# EAGLE design Adafruit Metro ESP32-S2 (EAGLE 9.6.2)
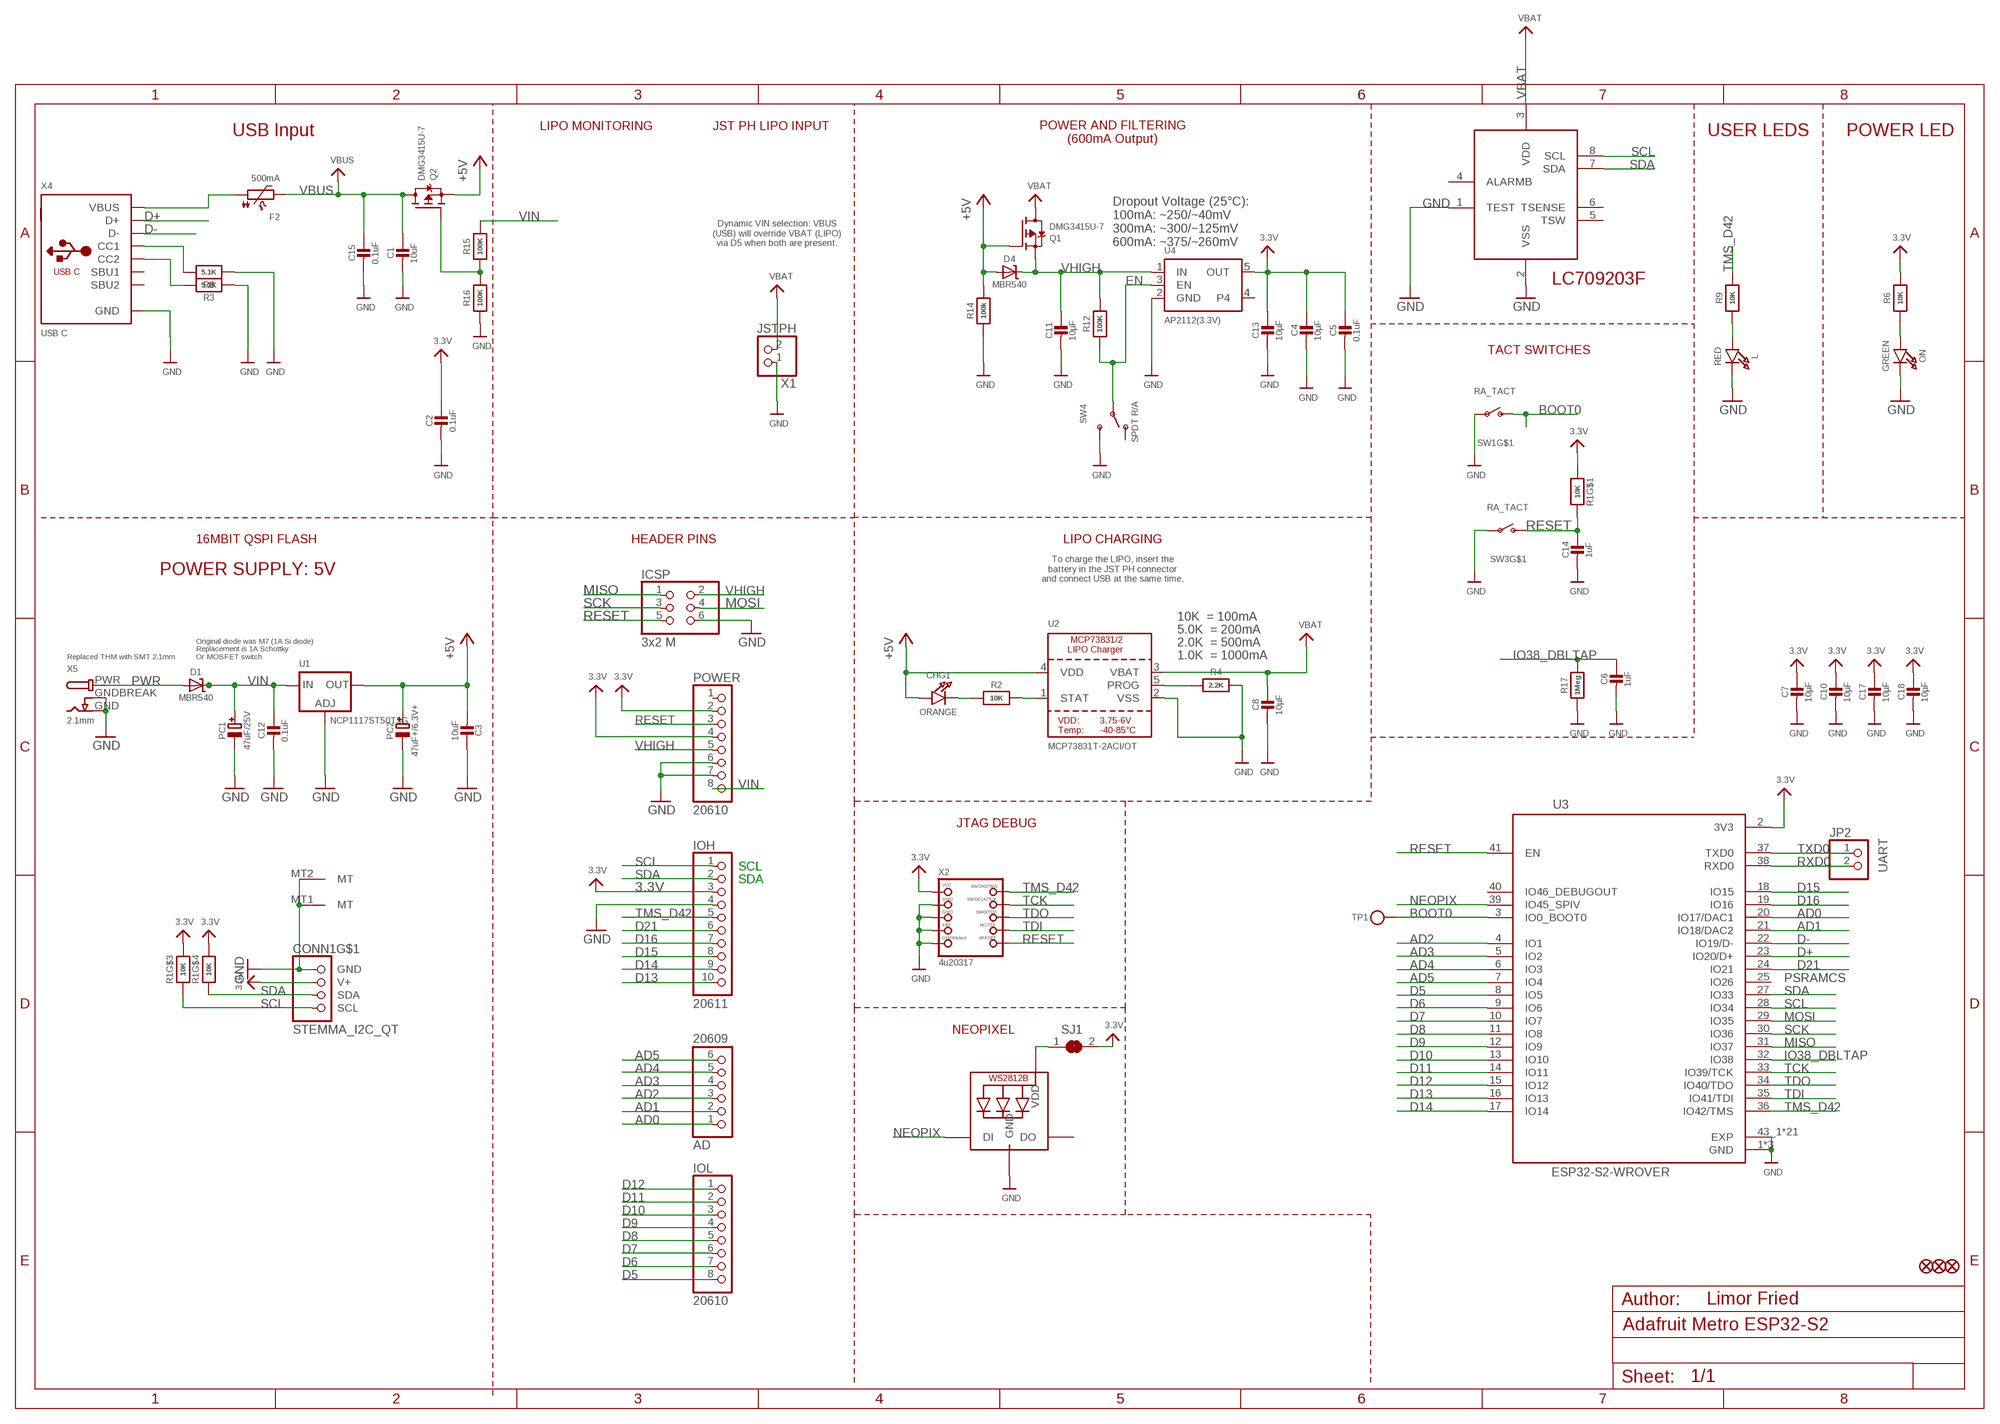
[diagram p0: schematic, sheet 1]

## Parts
AD  20609  HEADER-1X6OVALWAVE  [1X06_OVALWAVE]
C1  10uF  CAP_CERAMIC0805-NOOUTLINE  [0805-NO]
C2  0.1uF  CAP_CERAMIC0603_NO  [0603-NO]
C3  10uF  CAP_CERAMIC0805-NOOUTLINE  [0805-NO]
C4  10µF  CAP_CERAMIC0805-NOOUTLINE  [0805-NO]
C5  0.1uF  CAP_CERAMIC0603_NO  [0603-NO]
C6  1uF  CAP_CERAMIC0603_NO  [0603-NO]
C7  10µF  CAP_CERAMIC0805-NOOUTLINE  [0805-NO]
C8  10µF  CAP_CERAMIC0805-NOOUTLINE  [0805-NO]
C10  10µF  CAP_CERAMIC0805-NOOUTLINE  [0805-NO]
C11  10µF  CAP_CERAMIC0805-NOOUTLINE  [0805-NO]
C12  0.1uF  CAP_CERAMIC0603_NO  [0603-NO]
C13  10µF  CAP_CERAMIC0805-NOOUTLINE  [0805-NO]
C14  1uF  CAP_CERAMIC0603_NO  [0603-NO]
C15  0.1uF  CAP_CERAMIC0603_NO  [0603-NO]
C17  10µF  CAP_CERAMIC0805-NOOUTLINE  [0805-NO]
C18  10µF  CAP_CERAMIC0805-NOOUTLINE  [0805-NO]
CHG1  ORANGE  LED0603_NOOUTLINE  [CHIPLED_0603_NOOUTLINE]
CONN1  STEMMA_I2C_QT  [JST_SH4]
D1  MBR540  DIODE-SCHOTTKYSOD-123  [SOD-123]
D4  MBR540  DIODE-SCHOTTKYSOD-123  [SOD-123]
F2  500mA  PTC1206  [1206]
FD1  FIDUCIAL_1MM  [FIDUCIAL_1MM]
FD2  FIDUCIAL_1MM  [FIDUCIAL_1MM]
FD3  FIDUCIAL_1MM  [FIDUCIAL_1MM]
IC2  LC709203F  [WDFN8_3X4_0.65]
ICSP  3x2 M  HEADER-2X3  [2X03_ROUND_70MIL]
IOH  20611  HEADER-1X10OVALWAVE  [1X10_OVALWAVE]
IOL  20610  HEADER-1X8OVALWAVE  [1X08_OVALWAVE]
JP2  UART  HEADER-1X2ROUND  [1X02_ROUND]
L  RED  LED0603_NOOUTLINE  [CHIPLED_0603_NOOUTLINE]
LED1  WS2812B3535  [LED3535]
ON  GREEN  LED0603_NOOUTLINE  [CHIPLED_0603_NOOUTLINE]
PC1  47uF/25V  CAP_ELECTROLYTICPANASONIC_D  [PANASONIC_D]
PC2  47uF+/6.3V+  CAP_ELECTROLYTICPANASONIC_D  [PANASONIC_D]
POWER  20610  HEADER-1X8OVALWAVE  [1X08_OVALWAVE]
Q1  DMG3415U-7  MOSFET-P  [SOT23-R]
Q2  DMG3415U-7  MOSFET-P  [SOT23-R]
R1  10K  RESISTOR_4PACK  [RESPACK_4X0603]
R2  10K  RESISTOR_0603_NOOUT  [0603-NO]
R3  5.1K  RESISTOR_0603_NOOUT  [0603-NO]
R4  2.2K  RESISTOR_0603_NOOUT  [0603-NO]
R6  10K  RESISTOR_0603_NOOUT  [0603-NO]
R8  5.1K  RESISTOR_0603_NOOUT  [0603-NO]
R9  10K  RESISTOR_0603_NOOUT  [0603-NO]
R12  100K  RESISTOR_0603_NOOUT  [0603-NO]
R14  100k  RESISTOR_0603_NOOUT  [0603-NO]
R15  100K  RESISTOR_0603_NOOUT  [0603-NO]
R16  100K  RESISTOR_0603_NOOUT  [0603-NO]
R17  1Meg  RESISTOR_0603_NOOUT  [0603-NO]
SJ1  SOLDERJUMPER_CLOSED  [SOLDERJUMPER_CLOSEDWIRE]
SW1  RA_TACT  SWITCH_SPST_TACT_RA  [SPST_TACTILE_RA]
SW3  RA_TACT  SWITCH_SPST_TACT_RA  [SPST_TACTILE_RA]
SW4  SPDT R/A  SWITCH_SPDT  [SPDT_SMT_SSSS811101]
TP1  TESTPOINTROUND1.5MMNO  [TESTPOINT_ROUND_1.5MM_NO]
U1  NCP1117ST50T3G  LM1117SOT223-REFLOW  [SOT223-R]
U2  MCP73831T-2ACI/OT  MCP73831/2  [SOT23-5]
U3  ESP32-S2-WROVER  [MODULE_ESP32-S2-WROVER]
U4  AP2112(3.3V)  VREG_SOT23-5  [SOT23-5]
X1  JSTPH  CON_JST_PH_2PIN_BATT  [JSTPH2_BATT]
X2  4u20317  JTAG-CORTEXBOXPOSTS  [2X05_1.27MM_BOX_POSTS]
X4  USB C  USB_C  [USB_C_CUSB31-CFM2AX-01-X]
X5  2.1mm  DCBARRELPTH  [DCJACK_2MM_PTH]

## Nets
3.3V [Power]: C2.1 C4.1 C5.1 C7.1 C10.1 C13.1 C17.1 C18.1 CONN1.2(V+) IOH.3 POWER.2 POWER.4 R1.1 R1.5 R1.6 R6.2 SJ1.2 U3.2(3V3) U4.5(OUT) X2.1(VCC)
+5V [Power]: C3.2 CHG1.A D4.A PC2.+ Q1.1(G) Q2.2(S) R14.2 U1.2(OUT) U1.4(OUT) U2.4(VDD)
AD0: AD.1 U3.20(IO17/DAC1)
AD1: AD.2 U3.21(IO18/DAC2)
AD2: AD.3 U3.4(IO1)
AD3: AD.4 U3.5(IO2)
AD4: AD.5 U3.6(IO3)
AD5: AD.6 U3.7(IO4)
BOOT0: SW1.2(S) TP1.P$1 U3.3(IO0_BOOT0)
D5: IOL.8 U3.8(IO5)
D6: IOL.7 U3.9(IO6)
D7: IOL.6 U3.10(IO7)
D8: IOL.5 U3.11(IO8)
D9: IOL.4 U3.12(IO9)
D10: IOL.3 U3.13(IO10)
D11: IOL.2 U3.14(IO11)
D12: IOL.1 U3.15(IO12)
D13: IOH.10 U3.16(IO13)
D14: IOH.9 U3.17(IO14)
D15: IOH.8 U3.18(IO15)
D16: IOH.7 U3.19(IO16)
D21: IOH.6 U3.24(IO21)
D+: U3.23(IO20/D+) X4.A6(D+) X4.B6(D+)
D-: U3.22(IO19/D-) X4.A7(D-) X4.B7(D-)
EN: R12.1 SW4.B(P) U4.3(EN)
GND [lowpower]: C1.2 C2.2 C3.1 C4.2 C5.2 C6.2 C7.2 C8.2 C10.2 C11.2 C12.2 C13.2 C14.2 C15.2 C17.2 C18.2 CONN1.1(GND) CONN1.MT1(MT) CONN1.MT2(MT) IC2.1(TEST) IC2.2(VSS) ICSP.6 IOH.4 L.C LED1.4(GND) ON.C PC1.- PC2.- POWER.6 POWER.7 R3.1 R4.2 R8.1 R14.1 R16.1 R17.1 SW1.1(P) SW3.1(P) SW4.C(S) U1.1(ADJ) U2.2(VSS) U3.1(GND) U3.26(GND) U3.42(GND) U3.43_1(EXP) U3.43_2(EXP) U3.43_3(EXP) U3.43_4(EXP) U3.43_5(EXP) U3.43_6(EXP) U3.43_7(EXP) U3.43_8(EXP) U3.43_9(EXP) U3.43_10(EXP) U3.43_11(EXP) U3.43_12(EXP) U3.43_13(EXP) U3.43_14(EXP) U3.43_15(EXP) U3.43_16(EXP) U3.43_17(EXP) U3.43_18(EXP) U3.43_19(EXP) U3.43_20(EXP) U3.43_21(EXP) U4.2(GND) X1.1 X2.3(GND) X2.5(GND) X2.7(KEY) X2.9(GNDDETECT) X4.A1B12(GND) X4.B1A12(GND) X5.GND X5.GNDBREAK
IO38_DBLTAP: C6.1 R17.2 U3.32(IO38)
MISO: ICSP.1 U3.31(IO37)
MOSI: ICSP.4 U3.29(IO35)
N$1: L.A R9.1
N$2: Q2.1(G) R15.1 R16.2
N$3: ON.A R6.1
N$4: CHG1.C R2.1
N$5 [Power]: LED1.2(VDD) SJ1.1
N$6: R2.2 U2.1(STAT)
N$7: R8.2 X4.A5(CC1)
N$8: R3.2 X4.B5(CC2)
N$9: R4.1 U2.5(PROG)
N$13: F2.1 X4.A4B9(VBUS) X4.B4A9(VBUS)
NEOPIX: LED1.1(DI) U3.39(IO45_SPIV)
PWR: D1.A X5.PWR
RESET: C14.1 ICSP.5 POWER.3 R1.8 SW3.2(S) U3.41(EN) X2.10(NRESET)
RXD0: JP2.2 U3.38(RXD0)
SCK: ICSP.3 U3.30(IO36)
SCL: CONN1.4(SCL) IC2.8(SCL) IOH.1 R1.3 U3.28(IO34)
SDA: CONN1.3(SDA) IC2.7(SDA) IOH.2 R1.4 U3.27(IO33)
TCK: U3.33(IO39/TCK) X2.4(SWDCLK)
TDI: U3.35(IO41/TDI) X2.8(TDI)
TDO: U3.34(IO40/TDO) X2.6(SWO)
TMS_D42: IOH.5 R9.2 U3.36(IO42/TMS) X2.2(SWDIO)
TXD0: JP2.1 U3.37(TXD0)
VBAT [Power]: C8.1 IC2.3(VDD) Q1.3(D) U2.3(VBAT) X1.2
VBUS: C1.1 C15.1 F2.2 Q2.3(D)
VHIGH [Power]: C11.1 D4.C ICSP.2 POWER.5 Q1.2(S) R12.2 U4.1(IN)
VIN [USB]: C12.1 D1.C PC1.+ POWER.8 R15.2 U1.3(IN)
Unconnected: IC2.4(ALARMB) IC2.5(TSW) IC2.6(TSENSE) LED1.3(DO) POWER.1 R1.2 R1.7 SW1.MT1(MT) SW1.MT2(MT) SW3.MT1(MT) SW3.MT2(MT) SW4.A(O) U3.25(IO26) U3.40(IO46_DEBUGOUT) U4.4 X4.A8(SBU1) X4.B8(SBU2)

## Notes on the sheet
- USB Input | LIPO MONITORING | JST PH LIPO INPUT | USER LEDS | POWER LED
- POWER AND FILTERING
  (600mA Output)
- Dynamic VIN selection: VBUS
  (USB) will override VBAT (LIPO)
  via D5 when both are present.
- Dropout Voltage (25°C):
  100mA: ~250/~40mV
  300mA: ~300/~125mV
  600mA: ~375/~260mV
- TACT SWITCHES
- 16MBIT QSPI FLASH | HEADER PINS | LIPO CHARGING
- POWER SUPPLY: 5V
- To charge the LIPO, insert the
  battery in the JST PH connector
  and connect USB at the same time.
- 10K  = 100mA
- 5.0K  = 200mA
- 2.0K  = 500mA
- Replaced THM with SMT 2.1mm
- Original diode was M7 (1A Si diode)
  Replacement is 1A Schottky
  Or MOSFET switch
- 1.0K  = 1000mA
- JTAG DEBUG
- SCL
- SDA
- PSRAMCS
- NEOPIXEL
- Limor Fried

## Library data of the parts
AD = microbuilder:HEADER-1X6: PIN HEADER
C1-C8 C10-C15 C17 C18 = microbuilder:CAP_CERAMIC: Ceramic Capacitors For new designs, use the packages preceded by an '_' character since they are more reliable: The following footprints should be used on most boards: _0402 - Standard footprint for regular board layouts _0603 - Standard footprint for regular board layouts _0805 - Standard footprint for regular board layouts _1206 - Standard footprint for regular board layouts For extremely tight-pitch boards where space is at a premium, the following 'micro-pitch' footprints can be used (smaller pads, no silkscreen outline, etc.): _0402MP - Micro-pitch footprint for very dense/compact boards _0603MP - Micro-pitch footprint for very dense/compact boards _0805MP - Micro-pitch footprint for very dense/compact boards _1206MP - Micro-pitch footprint for very dense/compact boards
CHG1 L ON = microbuilder:LED: LED 0603 - 0603 Surface Mount Package 2mA: Green LED - Low Power (3.9mcd, 2ma, 1.7Vf) - Digikey: 475-2709-2-ND Orange LED - Low Power (9.8mcd, 2ma, 1.8Vf) - Digikey: 475-1194-2-ND Red LED - Low Power (5mcd, 2ma, 1.8Vf) - Digikey: 475-1195-2-ND Yellow LED - Low Power (7mcd, 2ma, 1.8Vf) - Digikey: 475-1196-2-ND 5mA: Blue LED - Low Power (17mcd, 5ma, 2.9Vf) - Digikey: LNJ937W8CRACT-ND 0805 - 0805 Surface Mount Package 2mA: Red LED (8.8mcd, 2mA, 1.8Vf, Clear) - Low Power [Digikey: 475-2510-1-ND] Green LED (5mcd, 2mA, 1.8Vf, Clear) - Low Power [Digikey: 475-2730-1-ND] Yellow LED (11.3mcd, 2mA, 1.8Vf, Clear) - Low Power [Digikey: 475-2555-1-ND] 20mA: Red LED (104mcd, 20mA, Diffused) - LS R976 [Digikey: 475-1278-6-ND] Red LED (12mcd, 20mA, 2.0Vf, Clear) - APT2012EC [Digikey: 754-1128-1-ND] Green LED (15mcd, 20mA, 2.2Vf, Clear) - APT2012GC [Digikey: 754-1131-1-ND] Orange LED (160mcd, 20mA, 2.1Vf, Clear) - APT2012SECK [Digikey: 754-1130-1-ND] 1206 - 1206 Surface Mount Package Green LED (26mcd, 20mA, Diffused) - LG N971 [Digikey: 475-1407-6-ND] Red LED (15mcd, 20mA, Diffused) - LH N974 [Digikey: 475-1416-6-ND] Cree - Cree High-Power Surface Mount LEDs XPEBWT-L1-0000-00D50 - White 111lm 350mA 2.9Vf 6200K 110° XTEAWT-00-0000-00000LEE3 - White 114lm 350mA 2.85Vf 5000K 115° Everlight - Everlight 45-21 Series Surface Mount LEDs 45-21/QK2C-B2832AC2CB2/2T - Warm White 2000mcd 20mA 3.25Vf 3050K 120° 45-21/LK2C-B38452C4CB2/2T - Nuetral White 2000mcd 20mA 3.25Vf 4150K 120° 45-21/LK2C-B50634C6CB2/2T - Cold White 2200mcd 20mA 3.25Vf 5650K 120° PLCC2 Reverse Mount LS T77K-J1L2-1-0-2-R18-Z - Red 11.25mcd 2mA 1.8Vf 630nm 120° LO T77K-L1M2-24-Z - Orange 19.6mcd 2mA 1.8Vf 606nm 120° LY T77K-K2M1-26-Z - Yellow 15.7mcd 2mA 1.8Vf 587nm 120°
CONN1 = microbuilder:STEMMA_I2C
D1 D4 = microbuilder:DIODE-SCHOTTKY
F2 = microbuilder:PTC: PTC (Resettable Fuse) 1206 Package 250mA PTC (16V Max, Time-to-Trip: 0.08s) - Digikey: F2110CT-ND 1210 Package 100mA PTC (30V Max, Time-to-Trip: 0.6s) - Digikey: MF-USMF010-2CT-ND 1812 Package 750mA PTC (24V Max, Time-to-Trip: 0.2s) - Digikey: MF-MSMF075/24-2CT-ND
FD1-FD3 = microbuilder:FIDUCIAL: Fiducial Alignment Points Various fiducial points for machine vision alignment.; BOM: EXCLUDE
IC2 = microbuilder:LC709203F
ICSP = microbuilder:HEADER-2X3: PIN HEADER
IOH = microbuilder:HEADER-1X10: PIN HEADER
IOL POWER = microbuilder:HEADER-1X8: PIN HEADER
JP2 = microbuilder:HEADER-1X2: PIN HEADER
LED1 = microbuilder:WS2812B
PC1 PC2 = microbuilder:CAP_ELECTROLYTIC: Electrolytic Capacitors SMT PANASONIC_C - Size C Panasonic Electrolytic Aluminum Capacitor 47µF 16V 20% Electrolytic Capacitor [Digikey: PCE3890TR-ND] PANASONIC_D - Size D Panasonic Electrolytic Aluminum Capacitor 100µF 25V 20% Electrolytic Capacitor [Digikey: PCE3898TR-ND] PTH 3.5 mm grid, 8 mm diameter ... 3.5 mm grid, 10 mm diameter ...
Q1 Q2 = microbuilder:MOSFET-P: P-Channel Mosfet LEGEND VDS: Voltage Drain-Source ID: Drain Current RDS(ON): Drain-Source On-State Resistance VGS(TH): Gate-Source Threshold Voltage CISS: Drain-Source Input Capacitance SOT-23 Name VDS ID RDS(ON) VGS(TH) CISS Order Number IRLML5103 30V 760mA 600 mOhm -- 75pF @ 25V Digikey: IRLML5103PBFCT-ND IRLML6401 12V 4.3A 50 mOhm 950mV @ 250µA 830pF @ 10V Digikey: IRLML6401PBFTR-ND NTR0202PL 20V 400mA 800 mOhm 2.3V @ 250uA 70pF @ 5V Digikey: NTR0202PLT1GOSTR-ND NTR4101PT1G 20V 1.8A 85 mOhm 1.2V @ 250uA 675pF @ 10V Digikey: NTR4101PT1GOSCT-ND DMP2004K 20V 600mA 900 mOhm 1V @ 250uA 175pF @ 16V Digikey: DMP2004KDICT-ND PMV65XP 20V 3.9A 76 mOhm 950mV @ 1mA 725pF @ 20V Digikey: 568-2358-2-ND TO-252 Name VDS ID RDS(ON) VGS(TH) CISS Order Number AOD417 30V 25A 34 mOhm 3V @ 250µA 920pF @ 15V Digikey: 785-1106-2-ND PowerPak Name VDS ID RDS(ON) VGS(TH) CISS Order Number AON7401 30V 12A 14 mOhm 3V @ 250µA 2600pF @ 15V Digikey: 785-1302-1-ND
R1 = microbuilder:RESISTOR_4PACK: Resistor Packs (4 resistors) 4 x 0603 10K 1/16W - Digikey: YC164J-10KCT-ND
R2-R4 R6 R8 R9 R12 R14-R17 = microbuilder:RESISTOR: Resistors For new designs, use the packages preceded by an '_' character since they are more reliable: The following footprints should be used on most boards: _0402 - Standard footprint for regular board layouts _0603 - Standard footprint for regular board layouts _0805 - Standard footprint for regular board layouts _1206 - Standard footprint for regular board layouts For extremely tight-pitch boards where space is at a premium, the following 'micro-pitch' footprints can be used (smaller pads, no silkscreen outline, etc.): _0402MP - Micro-pitch footprint for very dense/compact boards _0603MP - Micro-pitch footprint for very dense/compact boards _0805MP - Micro-pitch footprint for very dense/compact boards _1206MP - Micro-pitch footprint for very dense/compact boards
SJ1 = microbuilder:SOLDERJUMPER_CLOSED: Solder Jumper - Closed These solder jumpers are closed by default CLOSEDWIRE - 10 mil trace between pads that can be cut and resoldered later CLOSEDPERM - 63 mil trace between pads for a permanent connection (used to 'bridge' two signals, a shameless hack for Eagle). Can double as a test point as well (no cream layer)
SW1 SW3 = microbuilder:SWITCH_SPST: Switch - SPST 4UCon 19192 (6.7x2.6mm SMT)
SW4 = microbuilder:SWITCH_SPDT: Switch - SPDT SSSS811101 - Horizontal Two Position SMT, 0.3A 4V [Mouser: 688-SSSS811101]
TP1 = microbuilder:TESTPOINT: Test Point Various test points for characterisation and PCB testing TESTPOINT_SMT - Compact Surface Mount Test Point [Digikey: 5016KTR-ND]
U1 = microbuilder:LM1117: LM1117 Voltage Regulator LM1117 Adjustable Voltage regulator [Digikey: LM1117IMP-ADJDKR-ND] LM1117 3.3V Voltage regulator [AP1117E33GDIDKR-ND] LM1117 5.0V Voltage regulator [AP1117E50GDIDKR-ND] SOT223-REFLOW - SOT223 package for solder paste/reflow ovens SOT223-WAVE - SOT223 package for hand-soldering (larger pads) Note: For the fixed-voltage regulators, simply set the ADJ pin to GND.
U2 = microbuilder:MCP73831/2: MCP73831/2 LIPO Charger VDD: 3.75 - 6V Temp -40 - 85°C Programmable Charge Rate: 15-500mA NOTE: STAT is a tri-state logic output on the MCP73831 and an open-drain output on the MCP73832. SOT23-5 with 4.2V output and tri-state logic on STAT = MCP73831T-2ACI/OT
U3 = adafruit_wireless:ESP32-S2-WROVER: WiFi 802.11b/g/n Transceiver Module 2.4GHz Antenna Not Included Surface Mount Check prices <https://snapeda.com/parts/ESP32-S2-WROVER/Espressif%20Systems/view-part/?ref=eda>; AVAILABILITY: Warning; DESCRIPTION: WiFi 802.11b/g/n Transceiver Module 2.4GHz Antenna Not Included Surface Mount; DIGIKEY-PURCHASE-URL: https://snapeda.com/shop?store=DigiKey&id=4614060; MF: Espressif Systems; MP: ESP32-S2-WROVER; PACKAGE: VFQFN-56 Espressif Systems; PRICE: None
U4 = microbuilder:VREG_SOT23-5: SOT23-5 Fixed Voltage Regulators Part Current Out V Out V In V Dropout θJA (°C/W) TJ (°C) Digikey Part No. ADP121 150mA 3.3V 3.4-5.5V 0.09V @ 150mA -- -- ADP121-AUJZ33R7CT-ND ADP121 150mA 3.0V 3.1-5.5V 0.09V @ 150mA -- -- ADP121-AUJZ30R7CT-ND ADP122 300mA 3.3V 3.4-5.5V 0.085V @ 300mA -- -- ADP122AUJZ-3.3-R7CT-ND ADP1712 300mA 3.3V 3.5-5.5V 0.17V @ 300mA -- -- ADP1712AUJZ-3.3-R7TR-ND AP7311 (Low Cost) 150mA 3.3V 3.5-6V 0.15V @ 150mA -- -- AP7311-33WG-7DICT-ND LD39015M18R 150mA 1.8V 1.9V-5.5V 0.08V @ 100mA -- -- 497-6977-1-ND LP2985A-33DBVR 150mA 3.3V 3.3-16V 0.28V @ 150mA 206 150 296-18479-1-ND MCP1824T-3302E/OT 300mA 3.3V 3.5V-6V 0.2V @ 300mA -- -- MCP1824T-3302E/OTCT-ND MIC5205-2.5YM5 TR 150mA 2.5V 2.7-16V 0.165V @ 150mA -- -- 576-1257-2-ND MIC5205-3.0YM5 TR 150mA 3.0V 3.2V-16V 0.165V @ 150mA -- -- 576-1258-2-ND MIC5205-3.3YM5 TR 150mA 3.3V 3.5V-16V 0.165V @ 150mA -- -- 576-1259-2-ND TPS780330220 150mA 3.3V+2.2V 3.6-5.5V 250mV Max -- -- 296-23332-1-ND TDA3663/N1,135 100mA 3.3V 3.5-45V 0.18V @ 50mA -- -- 568-5343-1-ND Max operating temp can be calculated using θJA, TJ (max junction temperature), and power in watts. Set the "Maximum Ambient Temperature" until it reaches TJ ("Max Junction Temperature"), which is the absolute limit for safe use of the regulator: Heat Sink Temperature Calculator <http://www.daycounter.com/Calculators/Heat-Sink-Temperature-Calculator.phtml> For example, With 12V source into a 3.3V LP2985 and a 30mA load, we are dissipating (12V-3.3V) * 0.03A = 0.261W. With a θJA of 206 °C/W, a TJ of 150°C, and 261mW we can safely use the chip without a heat sink up to 75°C (=147.1°C Junction Temperature).
X1 = microbuilder:CON_JST_PH_2PIN: JST 2-Pin Right-Angle Connector PH-Series - 4UConnector: 17311 SH-Series - 4UConnector: 07278
X2 = microbuilder:JTAG-CORTEX: Serial Wire (SW-DP) Connector Standard 0.05" 10-pin connector is for use with the Cortex M and Cortex A SWD (serial wire debugger) interface (SW-DP) Connectors 2x05_1.27MM_SMT - Inexpensive surface-mount header with bare pins, compatible with standard 10-pin SWD cables (4UCON: 16846) 2x05_1.27MM_BOX_NOPOSTS - Polarised surface-mount box (4UCON with caps: 19735, without caps: 15117 2x05_1.27MM_BOX_POSTS - Polarised surface-mount box with mounting holes (4UCON: 20317) Pinout: http://infocenter.arm.com/help/topic/com.arm.doc.faqs/attached/13634/cortex_debug_connectors.pdf http://www.keil.com/peripherals/coresight/connectors.asp
X4 = microbuilder:USB_C: USB Type-C USB 2.0 Connector
X5 = microbuilder:DCBARREL: DC Barrel Jack DCJACK_1.3MM_PTH - Through Hole 1.3mm Jack (4UConnector: 05536) DCJACK_2MM_PTH - Through Hole 2.0/2.1 Jack (4UConnector: 05537) DCJACK_2MM_SMT - SMT 2.0/2.1mm Jack(4UConnector: 03267)

## Net classes
2 lowpower: width 0.305 mm, drill 0.483 mm
3 Power: width 0.305 mm, drill 0.483 mm

## Board
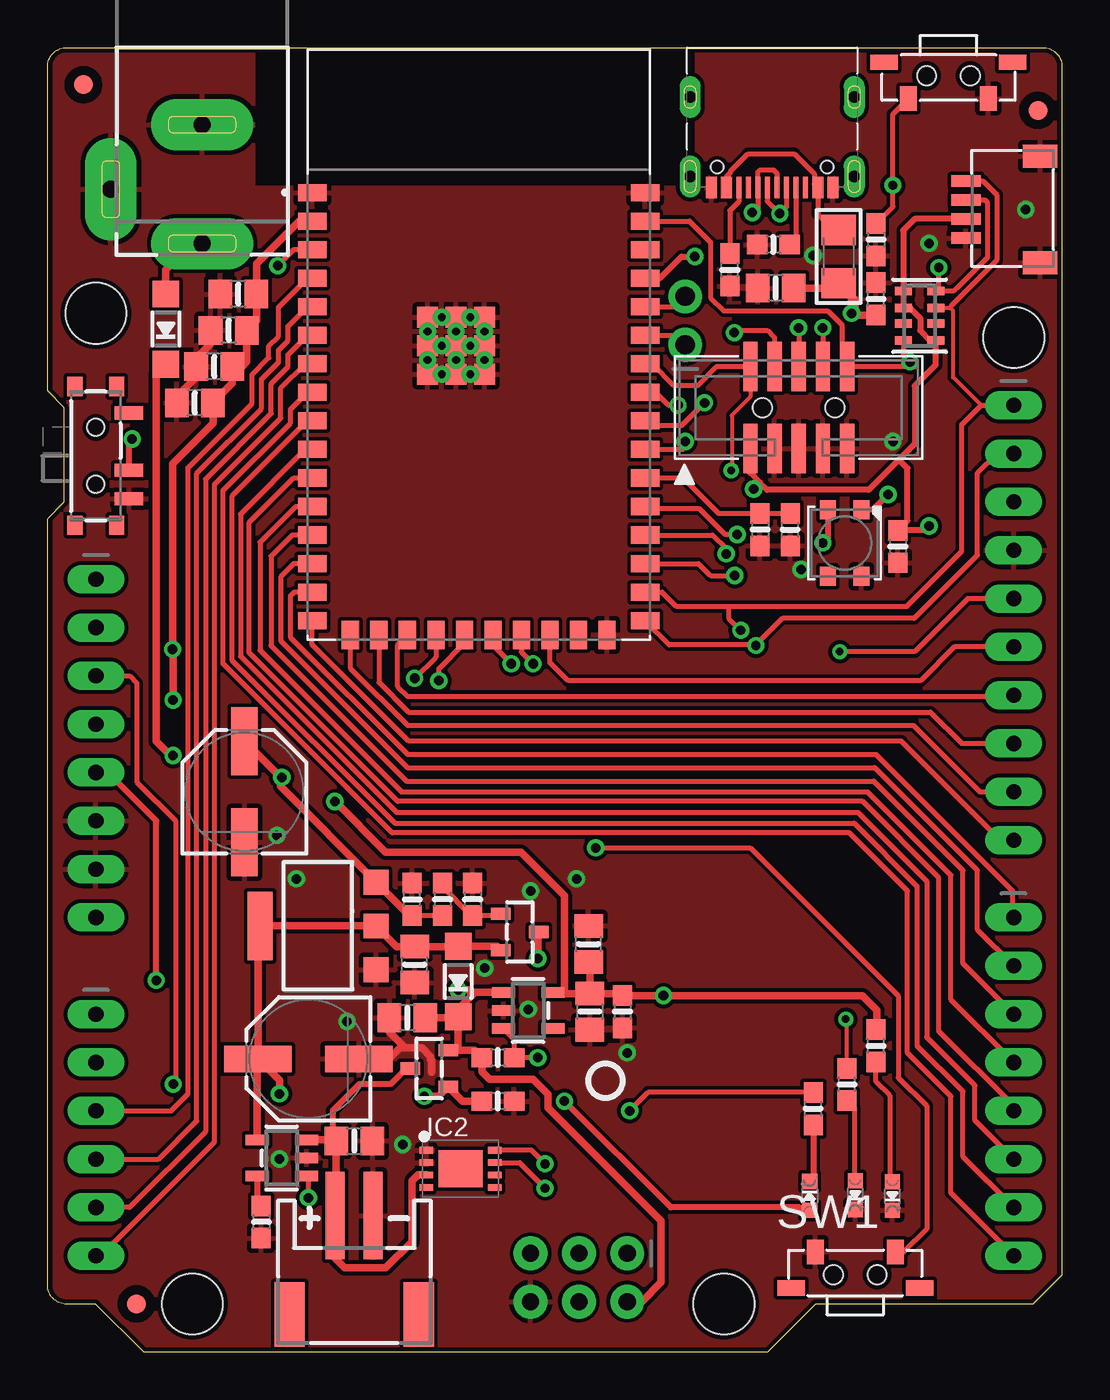
[diagram p1: board, top side]
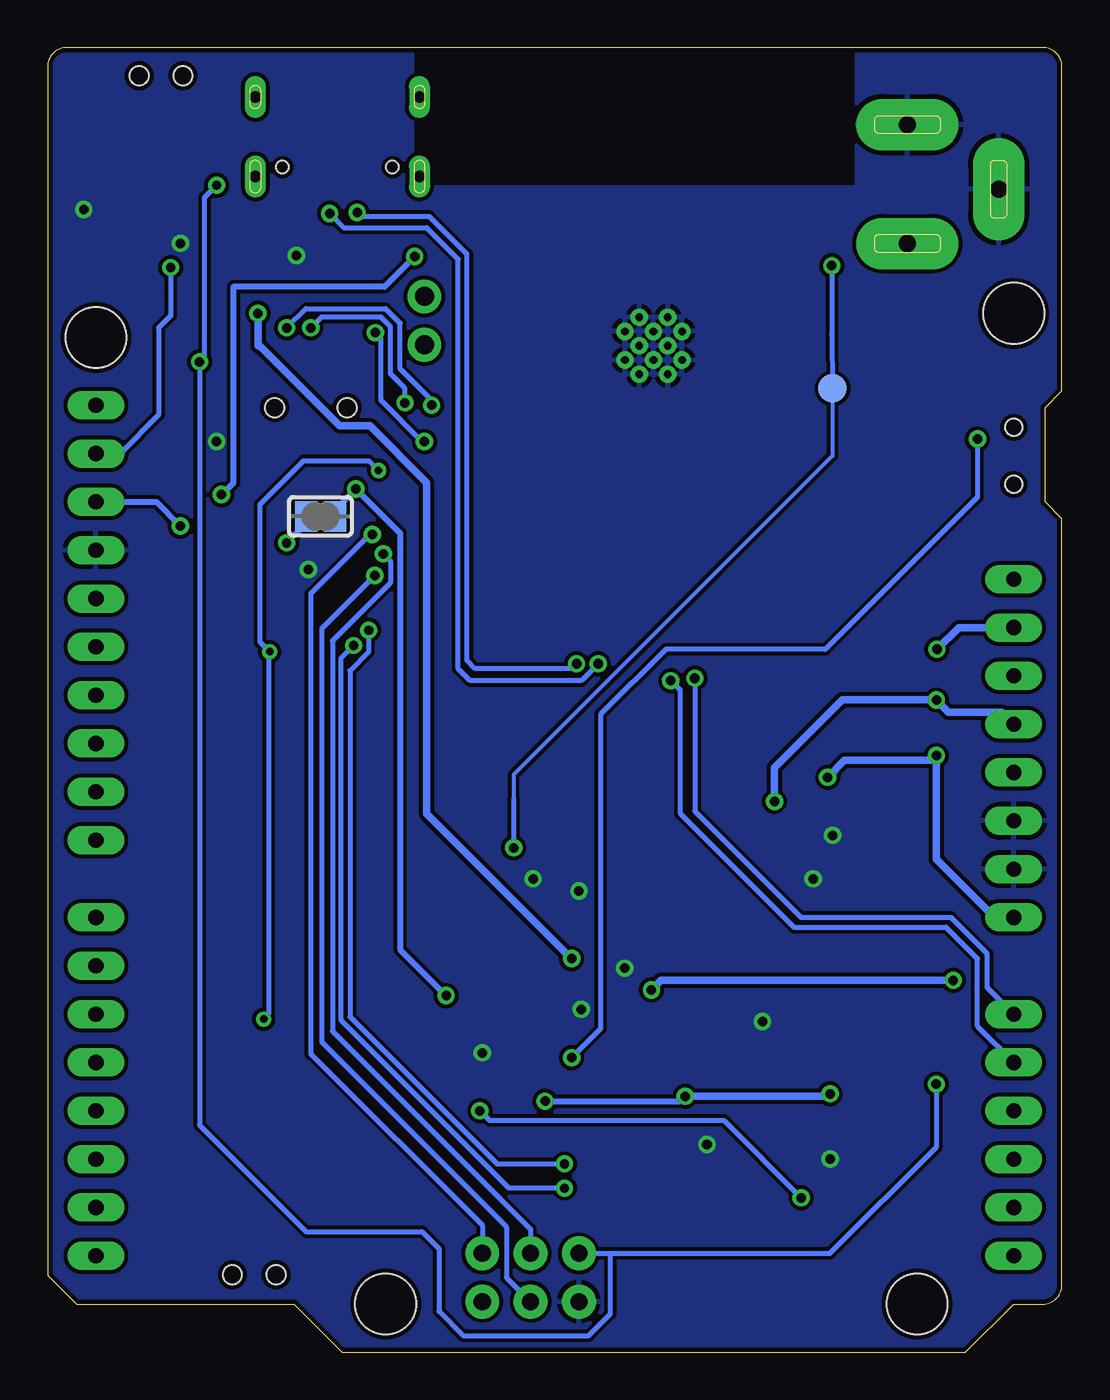
[diagram p2: board, bottom side, seen from below]

Size 53.34 x 68.58 mm. Coordinates in mm from the lower left corner, seen from the top.
Outline: 53.34,4.06 51.82,2.54 40.39,2.54 37.85,0 5.08,0 2.54,2.54 1,2.54 arc-90 0,3.54 0,43.81 0.89,44.7 0.89,49.66 0,50.55 0,67.58 arc-90 1,68.58 52.34,68.58 arc-90 53.34,67.58 53.34,4.06
Copper layers (1*16): Top 0.035mm / dielectric 1.5mm / Bottom 0.035mm
Design rules "adafruit *": minimum track width 8mil, minimum drill 15.5mil, track to track 8mil, track to pad 8mil, pad to pad 8mil, via to via 8mil, smd to smd 8mil, copper to edge 10mil, drill to drill 8mil, minimum pad ring 10mil, minimum via ring 8mil, stop-mask expansion 2mil, vias tented up to drill 20mil, thermal gap 10mil
Holes 3.2 mm at 35.56,2.54 7.62,2.54 50.8,53.34 2.54,54.61

### Footprints (pad centres in the part's own frame; a part is rotated, then mirrored left to right if it is on the bottom)
1X06_OVALWAVE = drill 0.8 pad 1.5 long: 1 -6.35,0; 2 -3.81,0; 3 -1.27,0; 4 1.27,0; 5 3.81,0; 6 6.35,0
0805-NO = smd 1.24 x 1.5: 1 -0.95,0; 2 0.95,0
0603-NO = smd 1.075 x 1: 1 -0.85,0; 2 0.85,0
CHIPLED_0603_NOOUTLINE = smd 0.8 x 0.8: A 0,-0.75; C 0,0.75
JST_SH4 = smd 0.6 x 1.55: 1 -1.5,2.514; 2 -0.5,2.514; 3 0.5,2.514; 4 1.5,2.514 | smd 1.2 x 1.8: MT1 -2.8,-1.386; MT2 2.8,-1.386
SOD-123 = smd 1.4 x 1.4: A 1.85,0; C -1.85,0
1206 = smd 1.6 x 1.8: 1 -1.4,0; 2 1.4,0
FIDUCIAL_1MM = smd 1 x 1: 1 0,0
WDFN8_3X4_0.65 = smd 0.7 x 0.35: 1 -1.8,0.975; 2 -1.8,0.325; 3 -1.8,-0.325; 4 -1.8,-0.975; 5 1.8,-0.975; 6 1.8,-0.325; 7 1.8,0.325; 8 1.8,0.975 | smd 2.3 x 1.96: P$9 0,0
2X03_ROUND_70MIL = drill 0.9 pad 1.778: 1 -2.54,-1.27; 2 -2.54,1.27; 3 0,-1.27; 4 0,1.27; 5 2.54,-1.27; 6 2.54,1.27
1X10_OVALWAVE = drill 0.8 pad 1.5 long: 1 -11.43,0; 2 -8.89,0; 3 -6.35,0; 4 -3.81,0; 5 -1.27,0; 6 1.27,0; 7 3.81,0; 8 6.35,0; 9 8.89,0; 10 11.43,0
1X08_OVALWAVE = drill 0.8 pad 1.5 long: 1 -8.89,0; 2 -6.35,0; 3 -3.81,0; 4 -1.27,0; 5 1.27,0; 6 3.81,0; 7 6.35,0; 8 8.89,0
1X02_ROUND = drill 1 pad 1.778: 1 -1.27,0; 2 1.27,0
LED3535 = smd 1 x 0.85: 1 -1.75,0.875; 2 -1.75,-0.875; 3 1.75,-0.875; 4 1.75,0.875
PANASONIC_D = smd 3.556 x 1.4: + 2.654,0; - -2.654,0
SOT23-R = smd 0.635 x 1.016: 1 -0.95,-1; 2 0.95,-1; 3 0,1
RESPACK_4X0603 = smd 0.45 x 0.9: 1 -1.3,-0.85; 2 -0.4,-0.85; 3 0.4,-0.85; 4 1.3,-0.85; 5 1.3,0.85; 6 0.4,0.85; 7 -0.4,0.85; 8 -1.3,0.85
SOLDERJUMPER_CLOSEDWIRE = smd 1.168 x 1.6: 1 -0.762,0; 2 0.762,0 | smd 0.635 x 0.203: WIRE 0,0
SPST_TACTILE_RA = smd 0.9 x 1.27: 1 -2.1,0.9; 2 2.1,0.9 | smd 1.45 x 0.8: MT1 -3.375,-1; MT2 3.375,-1 | hole 1: -1.15,-0.3; 1.15,-0.3
SPDT_SMT_SSSS811101 = smd 0.7 x 1.5: A -2.25,1.75; B 0.75,1.75; C 2.25,1.75 | smd 1 x 0.8: SUP1 -3.65,1.1; SUP2 -3.65,-1.1; SUP3 3.65,1.1; SUP4 3.65,-1.1 | hole 0.9: -1.5,0; 1.5,0
TESTPOINT_ROUND_1.5MM_NO = smd 1.5 x 1.5: P$1 0,0
SOT223-R = smd 1.3 x 1.3: 1 -2.3,-3.05; 2 0,-3.05; 3 2.3,-3.05 | smd 3.6 x 1.3: 4 0,3.05
SOT23-5 = smd 0.55 x 1.2: 1 -0.95,-1.3; 2 0,-1.3; 3 0.95,-1.3; 4 0.95,1.3; 5 -0.95,1.3
MODULE_ESP32-S2-WROVER = smd 1.5 x 0.9: 1 -8.75,8; 2 -8.75,6.5; 3 -8.75,5; 4 -8.75,3.5; 5 -8.75,2; 6 -8.75,0.5; 7 -8.75,-1; 8 -8.75,-2.5; 9 -8.75,-4; 10 -8.75,-5.5; 11 -8.75,-7; 12 -8.75,-8.5; 13 -8.75,-10; 14 -8.75,-11.5; 15 -8.75,-13; 16 -8.75,-14.5; 27 8.75,-14.5; 28 8.75,-13; 29 8.75,-11.5; 30 8.75,-10; 31 8.75,-8.5; 32 8.75,-7; 33 8.75,-5.5; 34 8.75,-4; 35 8.75,-2.5; 36 8.75,-1; 37 8.75,0.5; 38 8.75,2; 39 8.75,3.5; 40 8.75,5; 41 8.75,6.5; 42 8.75,8 | smd 0.9 x 1.5: 17 -6.75,-15.25; 18 -5.25,-15.25; 19 -3.75,-15.25; 20 -2.25,-15.25; 21 -0.75,-15.25; 22 0.75,-15.25; 23 2.25,-15.25; 24 3.75,-15.25; 25 5.25,-15.25; 26 6.75,-15.25 | smd 1.1 x 1.1: 43_1 -2.69,1.45; 43_2 -1.19,1.45; 43_3 0.31,1.45; 43_4 -2.69,-0.05; 43_5 -1.19,-0.05; 43_6 0.31,-0.05; 43_7 -2.69,-1.55; 43_8 -1.19,-1.55; 43_9 0.31,-1.55 | drill 0.4: 43_10 -1.94,1.45; 43_11 -0.44,1.45; 43_12 -2.69,0.7; 43_13 -1.19,0.7; 43_14 0.31,0.7; 43_15 -1.94,-0.05; 43_16 -0.44,-0.05; 43_17 -2.69,-0.8; 43_18 -1.19,-0.8; 43_19 0.31,-0.8; 43_20 -1.94,-1.55; 43_21 -0.44,-1.55
JSTPH2_BATT = smd 1 x 4.6: 1 -1,-3.7; 2 1,-3.7 | smd 1.6 x 3.4: NC1 -3.4,1.5; NC2 3.4,1.5
2X05_1.27MM_BOX_POSTS = smd 0.76 x 2.6: 1 -2.54,-2.15; 2 -2.54,2.15; 3 -1.27,-2.15; 4 -1.27,2.15; 5 0,-2.15; 6 0,2.15; 7 1.27,-2.15; 8 1.27,2.15; 9 2.54,-2.15; 10 2.54,2.15 | hole 1: -1.905,0; 1.905,0
USB_C_CUSB31-CFM2AX-01-X = smd 0.575 x 1.15: A1B12 -3.2,3.545; A4B9 -2.4,3.545; B1A12 3.2,3.545; B4A9 2.4,3.545 | smd 0.275 x 1.15: A5 -1.25,3.545; A6 -0.25,3.545; A7 0.25,3.545; A8 1.25,3.545; B5 1.75,3.545; B6 0.75,3.545; B7 -0.75,3.545; B8 -1.75,3.545 | drill 0.6 pad 1 long: M1 -4.32,2.97; M2 4.32,2.97; M3 -4.32,-1.21; M4 4.32,-1.21 | hole 0.65: 2.89,2.47; -2.89,2.47
DCJACK_2MM_PTH = drill 0.9 pad 2.7 long: GND 7.35,0; GNDBREAK 10.75,-4.8; PWR 13.6,0

### Placement (x,y rotation side)
AD  2.54,11.43 270 top
C1  38.29,55.94 180 top
C2  44.7,42.35 270 top
C3  19.3,20.38 90 top
C4  28.45,21.46 90 top
C5  30.23,17.91 270 top
C6  37.46,43.24 270 top
C7  10.03,55.63 180 top
C8  16.13,11.11 0 top
C10  9.53,53.72 180 top
C11  18.92,17.59 180 top
C12  19.18,23.81 90 top
C13  28.51,17.91 270 top
C14  43.56,58.48 270 top
C15  43.56,55.37 90 top
C17  8.76,51.82 180 top
C18  7.75,49.91 180 top
CHG1  40.07,8.23 0 top
CONN1  50.8,60.07 90 top
D1  6.22,53.78 90 top
D4  21.59,19.49 90 top
F2  41.59,57.59 270 top
FD1  52.07,65.28 270 top
FD2  4.68,2.55 270 top
FD3  1.89,66.63 270 top
IC2  21.72,9.65 0 top
ICSP  27.94,3.94 180 top
IOH  50.8,38.35 270 top
IOL  50.8,13.97 270 top
JP2  33.53,54.23 90 top
L  42.47,8.27 180 top
LED1  41.91,42.54 270 top
ON  44.42,8.22 180 top
PC1  10.35,29.46 90 top
PC2  13.72,15.43 180 top
POWER  2.54,31.75 270 top
Q1  20.07,14.92 90 top
Q2  24.83,22.1 270 top
R1  45.85,54.48 90 top
R2  40.26,12.81 90 top
R3  35.88,56.9 90 top
R4  11.24,6.86 270 top
R6  43.56,16.12 90 top
R8  38.16,58.23 0 top
R9  42.04,14.08 90 top
R12  23.69,15.49 180 top
R14  23.69,13.21 180 top
R15  20.76,23.81 270 top
R16  22.35,23.81 270 top
R17  39.05,43.24 90 top
SJ1  38.99,43.94 0 bottom
SW1  42.47,4.38 0 top
SW3  47.37,66.8 180 top
SW4  2.54,47.12 270 top
TP1  12.06,50.67 0 bottom
U1  14.22,22.42 90 top
U2  12.32,10.22 90 top
U3  22.67,52.96 0 top
U4  25.27,17.97 270 top
U$15  [PCBFEAT-REV-040]  29.34,14.29 270 top
U$52  [ESP32S2_TOP]  0,68.58 270 top
U$53  [ESP32S2_BOT]  0,0 90 bottom
X1  16.13,3.49 180 top
X2  39.5,49.66 0 top
X4  38.1,64.77 180 top
X5  8.13,71.88 270 top

### Tracks (layer width: path | path; a pad name or v marks a point on that pad's centre or on a via)
3.3V  (via drill 0.5)
  Top 0.305: 44.77,46.93 45.59,47.75 45.59,50.8 46.7,51.9 R1.1 46.42,53.18 45.89,53.71 45.89,54.37 45.38,54.88 R1.6 R1.5 45,58.97 45.6,59.57 CONN1.2 | 44.77,46.93 43.18,45.34 37.85,45.34 37.46,45.72 | X2.1 36.96,46.23 37.46,45.72 | v37.13,45.38 37.46,45.72 | v46.35,43.43 46.12,43.2 C2.1 45.21,43.71 45.21,46.48 44.77,46.93
  Top 0.406: U3.2 13.23,59.46 10.98,57.21 C7.1 10.98,54.23 C10.1 10.47,52.07 10.22,51.82 C17.1 9.71,50.93 C18.1 8.7,48.83 6.57,46.71 v6.57,36.96 6.6,36.93 v6.6,34.29 | C13.1 27.05,18.86 | 27.05,18.86 26.64,18.86 U4.5 | C13.1 28.51,20.45 C4.1 | v15.11,28.96 17.78,26.29 24.89,26.29 27.18,24 27.18,18.98 27.05,18.86 | C13.1 30.13,18.86 C5.1 v32.38,18.76 42.84,18.76 43.61,17.98 43.61,17.02 R6.2
  Bottom 0.305: SJ1.2 38.23,44.29 v37.13,45.38 34.8,43.05 34.8,21.17 v32.38,18.76 | IOH.3 47.62,44.7 v46.35,43.43
  Bottom 0.406: v6.57,36.96 5.43,38.1 POWER.2 | POWER.4 3.17,33.65 5.97,33.65 v6.6,34.29 11.56,34.29 15.11,30.73 v15.11,28.96
+5V  (via drill 0.5)
  Top 0.305: v27.18,13.21 32.77,7.62 39.56,7.62 39.7,7.48 CHG1.A
  Top 0.406: PC2.+ 11.06,22.3 U1.4 U1.2 18.36,21.33 C3.2 21.58,21.33 D4.A 23.63,21.34 Q2.2 | PC2.+ 11.02,15.39 U2.4 | R14.2 21.83,13.21 Q1.1 20.56,13.46 v19.81,13.46 | PC2.+ 12.19,14.3 v12.19,13.59
  Bottom 0.305: v27.18,13.21 20.07,13.21 v19.81,13.46
  Bottom 0.406: v19.81,13.46 12.32,13.46 v12.19,13.59
AD0  (via drill 0.5)
  Top 0.254: v19.3,35.43 20.42,36.55 U3.20
  Bottom 0.254: v19.3,35.43 19.3,28.45 13.72,22.86 5.84,22.86 3.94,20.96 3.94,19.18 AD.1
AD1  (via drill 0.5)
  Top 0.254: U3.21 21.92,37.29 20.57,35.94 v20.57,35.31
  Bottom 0.254: v20.57,35.31 20.07,34.8 20.07,28.32 14.1,22.35 6.1,22.35 4.45,20.7 4.45,17.14 AD.2
AD2
  Top 0.254: AD.3 6.5,12.7 7.39,13.59 7.39,46.51 10.74,49.86 10.74,51.38 11.63,52.27 11.63,52.9 12.14,53.41 12.14,54.93 13.67,56.46 U3.4
AD3
  Top 0.254: AD.4 5.84,10.16 7.85,12.17 7.85,46.2 11.25,49.61 11.25,51.15 12.14,52.04 12.14,52.67 12.65,53.18 12.65,53.94 13.67,54.96 U3.5
AD4
  Top 0.254: AD.5 4.32,7.62 8.31,11.61 8.31,45.9 11.76,49.35 11.76,50.92 12.65,51.81 12.65,52.44 13.67,53.46 U3.6
AD5
  Top 0.254: AD.6 2.79,5.08 8.76,11.05 8.76,45.59 12.27,49.1 12.27,50.69 13.54,51.96 U3.7
BOOT0  (via drill 0.5)
  Top 0.254: U3.3 12.95,57.96 v12.1,57.11 | v28.83,26.52 36.95,26.52 44.73,18.74 44.73,14.45 46.23,12.95 46.23,6.48 45.03,5.28 SW1.2
  Bottom 0.203: TP1.P$1 12.06,47.12 28.83,30.35 28.83,29.08
  Bottom 0.254: v12.1,57.11 12.1,53.5 TP1.P$1 | 28.83,29.08 v28.83,26.52
D5
  Top 0.254: IOL.8 47.5,8.38 47.5,13.46 45.21,15.75 45.21,24.26 42.16,27.3 18.13,27.3 9.23,36.2 9.23,45.3 12.78,48.84 12.78,49.57 13.54,50.34
  Top 0.305: U3.8 13.8,50.34 13.54,50.34
D6
  Top 0.254: IOL.7 48.13,10.29 48.13,13.72 45.72,16.13 45.72,24.51 42.42,27.81 18.27,27.81 9.69,36.39 9.69,45 13.53,48.83
  Top 0.305: U3.9 13.79,48.83 13.53,48.83
D7
  Top 0.254: U3.10 13.55,47.46 10.15,44.06 10.15,36.58 18.34,28.39 42.61,28.39 46.23,24.77 46.23,16.57 48.77,14.03 48.77,12.19 IOL.6
D8
  Top 0.254: U3.11 12.94,45.96 10.61,43.62 10.61,36.77 18.42,28.96 42.86,28.96 46.86,24.96 46.86,16.89 50.8,12.95 IOL.5
D9
  Top 0.254: U3.12 13.05,44.46 11.18,42.58 11.18,36.89 18.61,29.46 43.12,29.46 47.5,25.08 47.5,18.54 IOL.4
D10
  Top 0.254: U3.13 12.86,42.96 11.75,41.85 11.75,37.15 18.87,30.02 43.45,30.02 48.13,25.34 48.13,20.45 IOL.3
D11
  Top 0.254: U3.14 12.95,41.46 12.26,40.77 12.26,37.4 18.92,30.73 43.5,30.73 48.89,25.34 48.89,22.23 IOL.2
D12
  Top 0.254: U3.15 12.97,39.96 12.76,39.75 12.76,37.59 18.92,31.43 43.56,31.43 50.74,24.26 50.74,22.92 IOL.1
D13
  Top 0.254: IOH.10 50.1,26.92 44.89,32.13 18.99,32.13 13.92,37.2 U3.16
D14
  Top 0.254: U3.17 15.92,35.96 18.92,32.96 45.53,32.96 49.02,29.46 IOH.9
D15
  Top 0.254: U3.18 17.42,35.22 18.99,33.65 46.42,33.65 48.07,32 IOH.8
D16
  Top 0.254: U3.19 18.41,37.2 18.41,34.99 18.92,34.48 50.74,34.48 IOH.7
D21
  Top 0.254: IOH.6 47.69,37.08 45.91,35.31 27.37,35.31 26.42,36.25 U3.24
D+  (via drill 0.5)
  Top 0.254: U3.23 24.92,36.8 v25.53,36.2 | v37.06,59.91 37.35,59.91 X4.B6 37.35,62.04 37.46,62.15 38.18,62.15 38.35,61.98 X4.A6
  Bottom 0.254: v25.53,36.2 25.78,35.94 30.85,35.94 31.29,36.38 31.29,57.72 33.27,59.7 36.86,59.7 v37.06,59.91
D-  (via drill 0.5)
  Top 0.254: U3.22 23.42,37.16 v24.38,36.2 | X4.B7 38.85,60.21 v38.5,59.86 37.85,60.51 X4.A7
  Bottom 0.254: v24.38,36.2 25.27,35.31 31.12,35.31 31.75,35.94 31.75,57.47 33.4,59.12 37.76,59.12 v38.5,59.86
EN  (via drill 0.5)
  Top 0.254: U4.3 24.54,16.46 24.54,15.62 | 24.54,15.62 R12.1 | v25.78,15.49 24.66,15.49 24.54,15.62
  Top 0.305: SW4.B 4.29,47.85 v4.45,48.01
  Bottom 0.254: v4.45,48.01 4.45,44.96 12.45,36.96 20.83,36.96 24.26,33.53 24.26,17.02 v25.78,15.49
GND  (via drill 0.5)
  Top 0.406: C10.2 8.57,53.02 7.81,52.26 C17.2 7.81,51.25 6.8,50.23 C18.2 | PC2.- 17.97,15.43 18.54,16 18.8,16 | 18.8,16 19.69,16 20.15,15.54 20.15,15.39 20.19,15.34 20.19,14.73 | C11.2 17.97,16.83 18.8,16
  other vias: 12.06,27.18 39.62,41.15 44.45,47.88 51.43,60.07 46.35,58.29 40.26,57.66 27.81,24.89 25.4,24.26 22.99,20.19 25.27,18.03 30.48,15.75 15.75,17.4 13.08,24.89 12.19,10.16 18.67,10.92
  pour Top (rank 3): 53.09,68.58 53.09,0 0,0 0,68.58 10.79,68.58 10.79,61.21 34.16,61.21 34.16,68.58
  pour Bottom (rank 3): 53.09,68.58 53.09,0 0,0 0,68.58 10.79,68.58 10.79,61.21 34.16,61.21 34.16,68.58
IO38_DBLTAP
  Top 0.254: U3.32 33.42,45.96 35.28,44.09 C6.1 R17.2
MISO  (via drill 0.5)
  Top 0.254: U3.31 31.55,44.33 34.28,44.33 35.62,42.99 v36.26,42.99
  Bottom 0.254: v36.26,42.99 36.39,42.99 39.5,39.88 39.5,15.7 30.48,6.68 ICSP.1
MOSI  (via drill 0.5)
  Top 0.254: U3.29 34.23,41.46 34.86,40.83 v36.13,40.83
  Bottom 0.254: ICSP.4 29.21,3.94 29.21,6.6 38.93,16.32 38.93,38.04 v36.13,40.83
N$1
  Top 0.254: L.A 42.42,9.02 42.42,12.85 R9.1
N$2
  Top 0.254: Q2.1 23.74,22.96 R16.2 22.27,22.96 20.77,24.47 R15.1
N$3
  Top 0.254: ON.A 44.28,9.11 44.28,13.51 43.56,14.24 R6.1
N$4
  Top 0.254: R2.1
  Top 0.305: R2.1 40.27,9.18 CHG1.C
N$5  (via drill 0.48)
  Top 0.305: LED1.2 41.03,42.81 v40.77,42.54
  Bottom 0.305: v40.77,42.54 39.75,43.56 SJ1.1
N$6  (via drill 0.5)
  Top 0.254: v30.61,12.7 31.57,13.66 R2.2 | v13.72,8.13 13.72,9.18 U2.1
  Bottom 0.254: v30.61,12.7 30.1,12.19 17.78,12.19 v13.72,8.13
N$7
  Top 0.254: X4.A5 39.35,58.57 R8.2
N$8
  Top 0.254: X4.B5 36.35,60.48 35.88,60.01 R3.2
N$9
  Top 0.305: U2.5 11.02,7.71 R4.1
N$13
  Top 0.254: X4.B4A9 35.7,61.79 35.92,62.01 35.92,62.08 36.83,62.99 39.26,62.99 40.32,61.94 40.32,61.41 X4.A4B9 40.5,59.83 41.34,58.99 F2.1
NEOPIX  (via drill 0.5)
  Top 0.305: U3.39 32.2,56.46 33.34,57.59 v34.04,57.59 | v44.2,45.09 43.41,44.29 LED1.1
  Bottom 0.305: v34.04,57.59 35.62,56.01 43.56,56.01 43.56,45.72 v44.2,45.09
PWR
  Top 0.406: X5.PWR 7.61,58.28 6.22,56.9 D1.A
RESET  (via drill 0.48, 0.5)
  Top 0.254: 45.6,51.81 X2.10 41.78,52.06 41.78,53.97 41.02,54.74 35.56,54.74 34.86,55.43 34.86,58.36 33.76,59.46 U3.41 | POWER.3 4.32,35.56 4.7,35.18 4.7,29.97 6.73,27.94 6.73,14.22 v6.61,14.1 | v45.34,52.07 45,52.41 R1.8 | SW3.2 44.45,65.08 v44.45,61.34 44.45,60.22 C14.1
  Top 0.305: 45.6,51.81 v45.34,52.07
  Bottom 0.254: v6.61,14.1 6.61,10.79 12.19,5.21 23.75,5.21 | v44.45,61.34 45.09,60.71 45.09,52.32 v45.34,52.07 45.34,11.94 39.75,6.35 33.66,6.35 32.77,5.46 32.77,2.16 31.5,0.89 24.89,0.89 23.75,2.03 23.75,5.21 | ICSP.5 23.75,5.21
RXD0
  Top 0.254: U3.38 32.99,54.96 JP2.2
SCK  (via drill 0.5)
  Top 0.254: U3.30 34.96,42.96 35.69,42.23 v35.69,41.97
  Bottom 0.254: v35.69,41.97 35.31,41.59 35.31,40.45 38.35,37.4 38.35,16.89 27.94,6.48 ICSP.3
SCL  (via drill 0.48)
  Top 0.203: 49.09,49.78 47.62,51.24 47.62,54.74 47.48,54.88 | 47.48,54.88 R1.3 | 47.52,55.01 47.48,54.97 47.48,54.88
  Top 0.254: 35.81,39.2 45.17,39.2 48.07,42.1 48.07,48.77 49.09,49.78 IOH.1 | 35.81,39.2 33.07,39.2 32.31,39.96 U3.28 | CONN1.4 49.17,61.57 49.91,60.83 49.91,57.39 47.97,55.45 47.96,55.45 47.52,55.01 | 35.81,39.2 35.81,38.6 v36.45,37.96 | v26.16,9.91 25.44,10.63 IC2.8
  Bottom 0.254: v36.45,37.96 36.45,36.83 37.44,35.84 37.44,17.64 29.71,9.91 v26.16,9.91
SDA  (via drill 0.48)
  Top 0.254: IOH.2 49.91,47.24 48.89,46.23 48.89,41.91 45.57,38.59 38.65,38.59 37.25,37.19 | CONN1.3 49.28,60.57 49.4,60.45 49.4,57.53 47.78,55.91 47.77,55.91 47.64,55.78 R1.4 46.86,55.95 v46.86,57.02 | IC2.7 24.82,9.98 v26.16,8.64 | v37.25,37.15 37.25,37.19 | U3.27 32.69,37.19 37.25,37.19
  Bottom 0.254: v46.86,57.02 46.86,54.48 47.5,53.85 47.5,49.28 49.53,47.24 IOH.2 | v26.16,8.64 29.08,8.64 37.9,17.45 37.9,36.5 v37.25,37.15
TCK  (via drill 0.5)
  Top 0.254: U3.33 33.4,47.46 33.4,47.75 v33.53,47.87 | v36.11,53.59 36.24,53.72 37.85,53.72 38.23,53.34 X2.4
  Bottom 0.254: v33.53,47.87 33.66,47.87 35.81,50.03 35.81,53.3 v36.11,53.59
TDI  (via drill 0.5)
  Top 0.254: U3.35 31.96,50.46 32.64,49.78 v33.15,49.78 | v40.77,53.85 X2.8
  Bottom 0.254: v33.15,49.78 33.15,50.04 34.8,51.69 34.8,54.1 35.56,54.86 39.75,54.86 v40.77,53.85
TDO  (via drill 0.5)
  Top 0.254: U3.34 31.67,48.7 33.34,48.7 v34.54,49.91 | v39.5,53.85 X2.6
  Bottom 0.254: v34.54,49.91 34.54,50.67 35.31,51.43 35.31,53.91 35.8,54.41 38.94,54.41 v39.5,53.85
TMS_D42  (via drill 0.39)
  Top 0.203: X2.2 36.96,50.23 35.97,49.25 35.97,46.39 v35.94,46.35 | R9.2 42.04,17.45 v41.97,17.51
  Top 0.254: X2.2 35.18,51.81 34.19,50.82 32.94,50.82 31.8,51.96 U3.36 | IOH.5 48.39,39.62 45.59,36.83 v41.66,36.83
  Bottom 0.254: v41.97,17.51 41.72,17.77 41.72,36.77 v41.66,36.83 42.16,37.34 42.16,44.58 39.88,46.86 36.45,46.86 v35.94,46.35
TXD0
  Top 0.254: U3.37 33.03,53.46 JP2.1
VBAT
  Top 0.305: 14.99,11.3 14.99,12.71 16.38,14.1 18.03,14.1 18.86,14.92 Q1.3
  Top 0.406: U2.3 15.12,11.17 | 14.99,11.3 15.12,11.17 | 15.12,11.17 C8.1 15.18,7.24 X1.2 15.13,4.94 15.62,4.45 17.78,4.45 19.16,5.83 19.16,9.02 19.4,9.26 19.42,9.26 19.49,9.33 IC2.3
VBUS  (via drill 0.5)
  Top 0.406: F2.2 42.45,55.34 42.45,54.54 42.4,54.52 C15.1 | F2.2 42.28,55.51 v42.28,54.61 | v25.78,20.7 25.78,22.05 Q2.3 | F2.2 41.34,55.94 C1.1
  Bottom 0.406: v42.28,54.61 42.28,52.9 42.19,52.9 37.99,48.7 36.38,48.7 33.4,45.72 33.4,28.32 v25.78,20.7
VHIGH  (via drill 0.5)
  Top 0.305: v5.71,19.56 5.71,27.94 3.17,30.48 POWER.5
  Top 0.406: Q1.2 21.59,15.87 | 21.59,15.87 22.46,15.87 R12.2 22.84,14.76 23.24,14.35 25.53,14.35 26.32,13.56 26.32,12.85 32.26,6.91 32.26,3.68 31.24,2.67 ICSP.2 | 21.59,17.53 D4.C 21.59,18.03 22.35,18.8 | 21.59,17.53 21.59,15.87 | C11.1 21.53,17.59 21.59,17.53 | U4.1 22.48,18.92 22.35,18.8 | v21.59,19.05 22.1,19.05 22.35,18.8
  Bottom 0.406: v21.59,19.05 21.08,19.56 v5.71,19.56
VIN  (via drill 0.5)
  Top 0.254: R15.2 C12.1
  Top 0.406: PC1.+ 12.24,30.23 | 12.24,30.23 v12.32,30.23 | 12.24,30.23 12.24,29.75 U1.3 19.03,22.96 C12.1 | D1.C 5.71,51.43 5.71,32.13 6.48,31.37 v6.6,31.37
  Bottom 0.406: v12.32,30.23 11.43,31.12 6.6,31.12 v6.6,31.37 6.6,25.91 3.56,22.86 POWER.8

### Text on the board
214bmp: D:/SmartProjects/Snc/a4_bn_logo2.bmp